# EAGLE schematic Project_Schem_v1 (EAGLE 7.3.0)
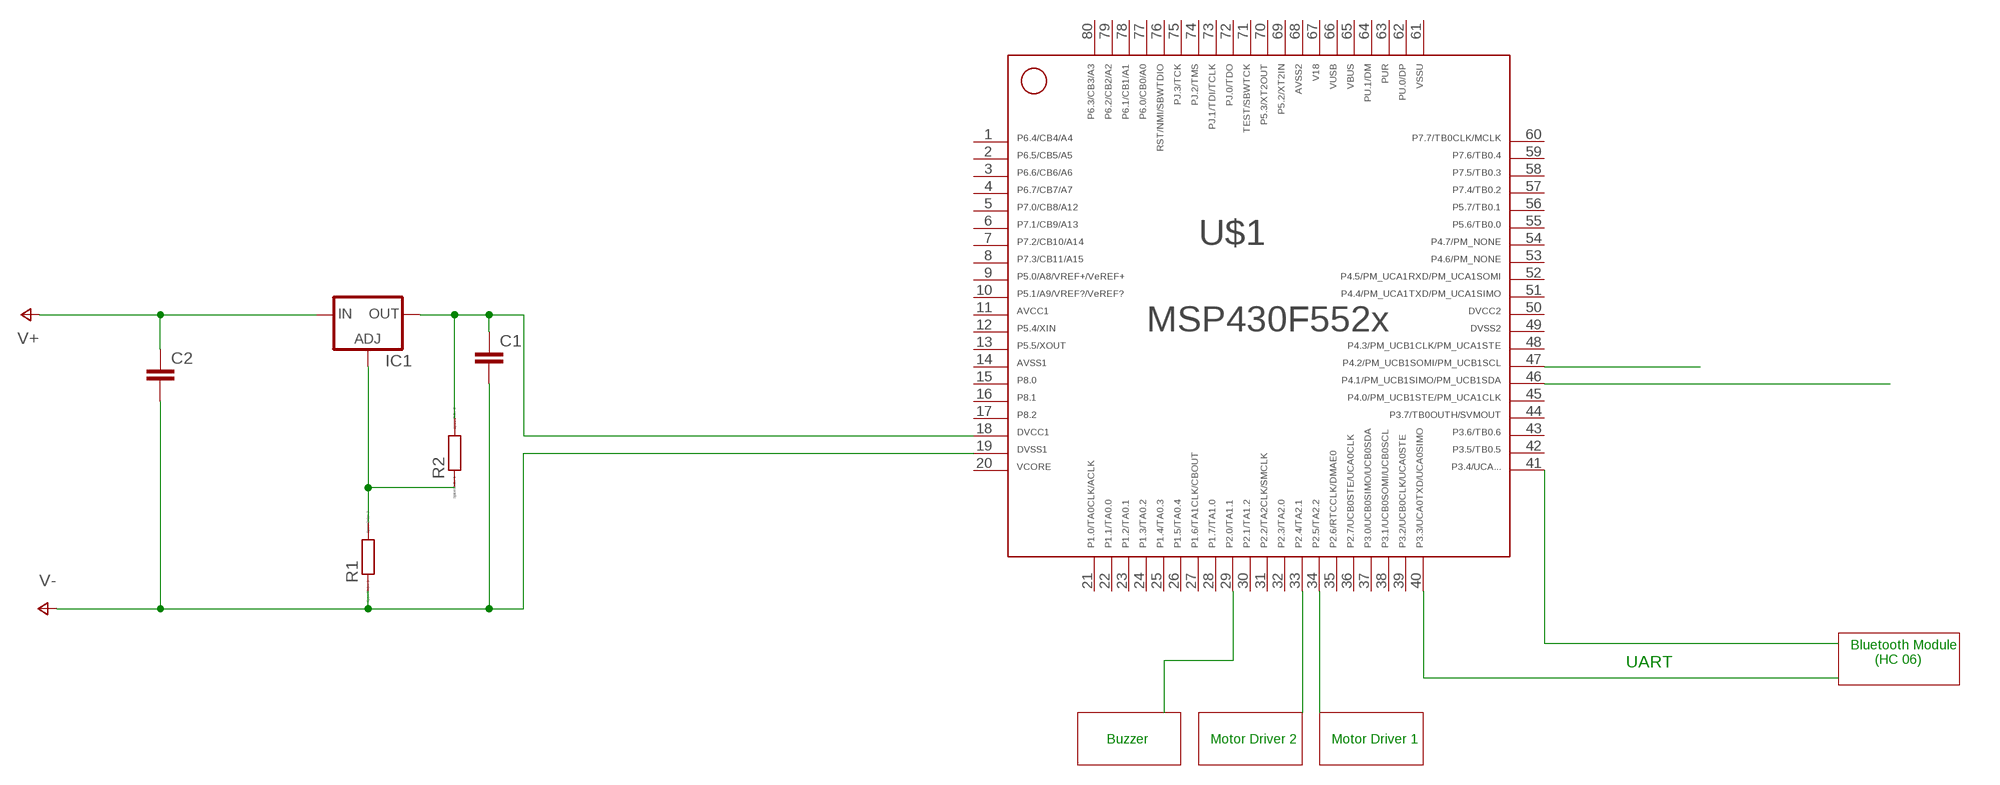
[diagram p0: schematic, sheet 1]

## Parts
C1  C2.5/2  [C2.5-2]
C2  C2.5/2  [C2.5-2]
IC1  LM317TS  [317TS]
R1  R0204/7  [0204/7]
R2  R0204/7  [0204/7]
U$1  F552X---PN80  [PN80]

## Nets
N$1: U$1.40
N$2: U$1.41
N$3: U$1.33
N$4: U$1.34
N$5: IC1.1(ADJ) R1.2 R2.1
N$6: C1.1 IC1.2(OUT) R2.2 U$1.18
N$7: U$1.29
N$8: U$1.47
N$9: U$1.46
V+: C2.1 IC1.3(IN)
V-: C1.2 C2.2 R1.1 U$1.19
Unconnected: U$1.1 U$1.2 U$1.3 U$1.4 U$1.5 U$1.6 U$1.7 U$1.8 U$1.9 U$1.10 U$1.12 U$1.13 U$1.15 U$1.16 U$1.17 U$1.21 U$1.22 U$1.23 U$1.24 U$1.25 U$1.26 U$1.27 U$1.28 U$1.30 U$1.31 U$1.32 U$1.35 U$1.36 U$1.37 U$1.38 U$1.39 U$1.42 U$1.43 U$1.44 U$1.45 U$1.48 U$1.51 U$1.52 U$1.53 U$1.54 U$1.55 U$1.56 U$1.57 U$1.58 U$1.59 U$1.60 U$1.62 U$1.63 U$1.64 U$1.69 U$1.70 U$1.71 U$1.72 U$1.73 U$1.74 U$1.75 U$1.76 U$1.77 U$1.78 U$1.79 U$1.80

## Notes on the sheet
- Bluetooth Module 
        (HC 06)
- UART
- Buzzer | Motor Driver 2 | Motor Driver 1

## Power pins joined to a net without a drawn wire
11: U$1.11
14: U$1.14
20: U$1.20
49: U$1.49
50: U$1.50
61: U$1.61
65: U$1.65
66: U$1.66
67: U$1.67
68: U$1.68

## Library data of the parts
C1 C2 = capacitor-wima:C: CAPACITOR naming: grid - package width
IC1 = v-reg:LM317TS: VOLTAGE REGULATOR
R1 R2 = eagle-ltspice:R: RESISTOR, European symbol; SPICEMODEL: NONE; SPICEPREFIX: R
U$1 = TI_MSP430_v16:F552X---PN80: ***MSP430F552X***PN80 http://www.ti.com/lit/gpn/msp430f5529 Rev1.0 06/2010 For F552X where X is 1,5,7,9